# EAGLE design RedpiLite (EAGLE 7.3.0)
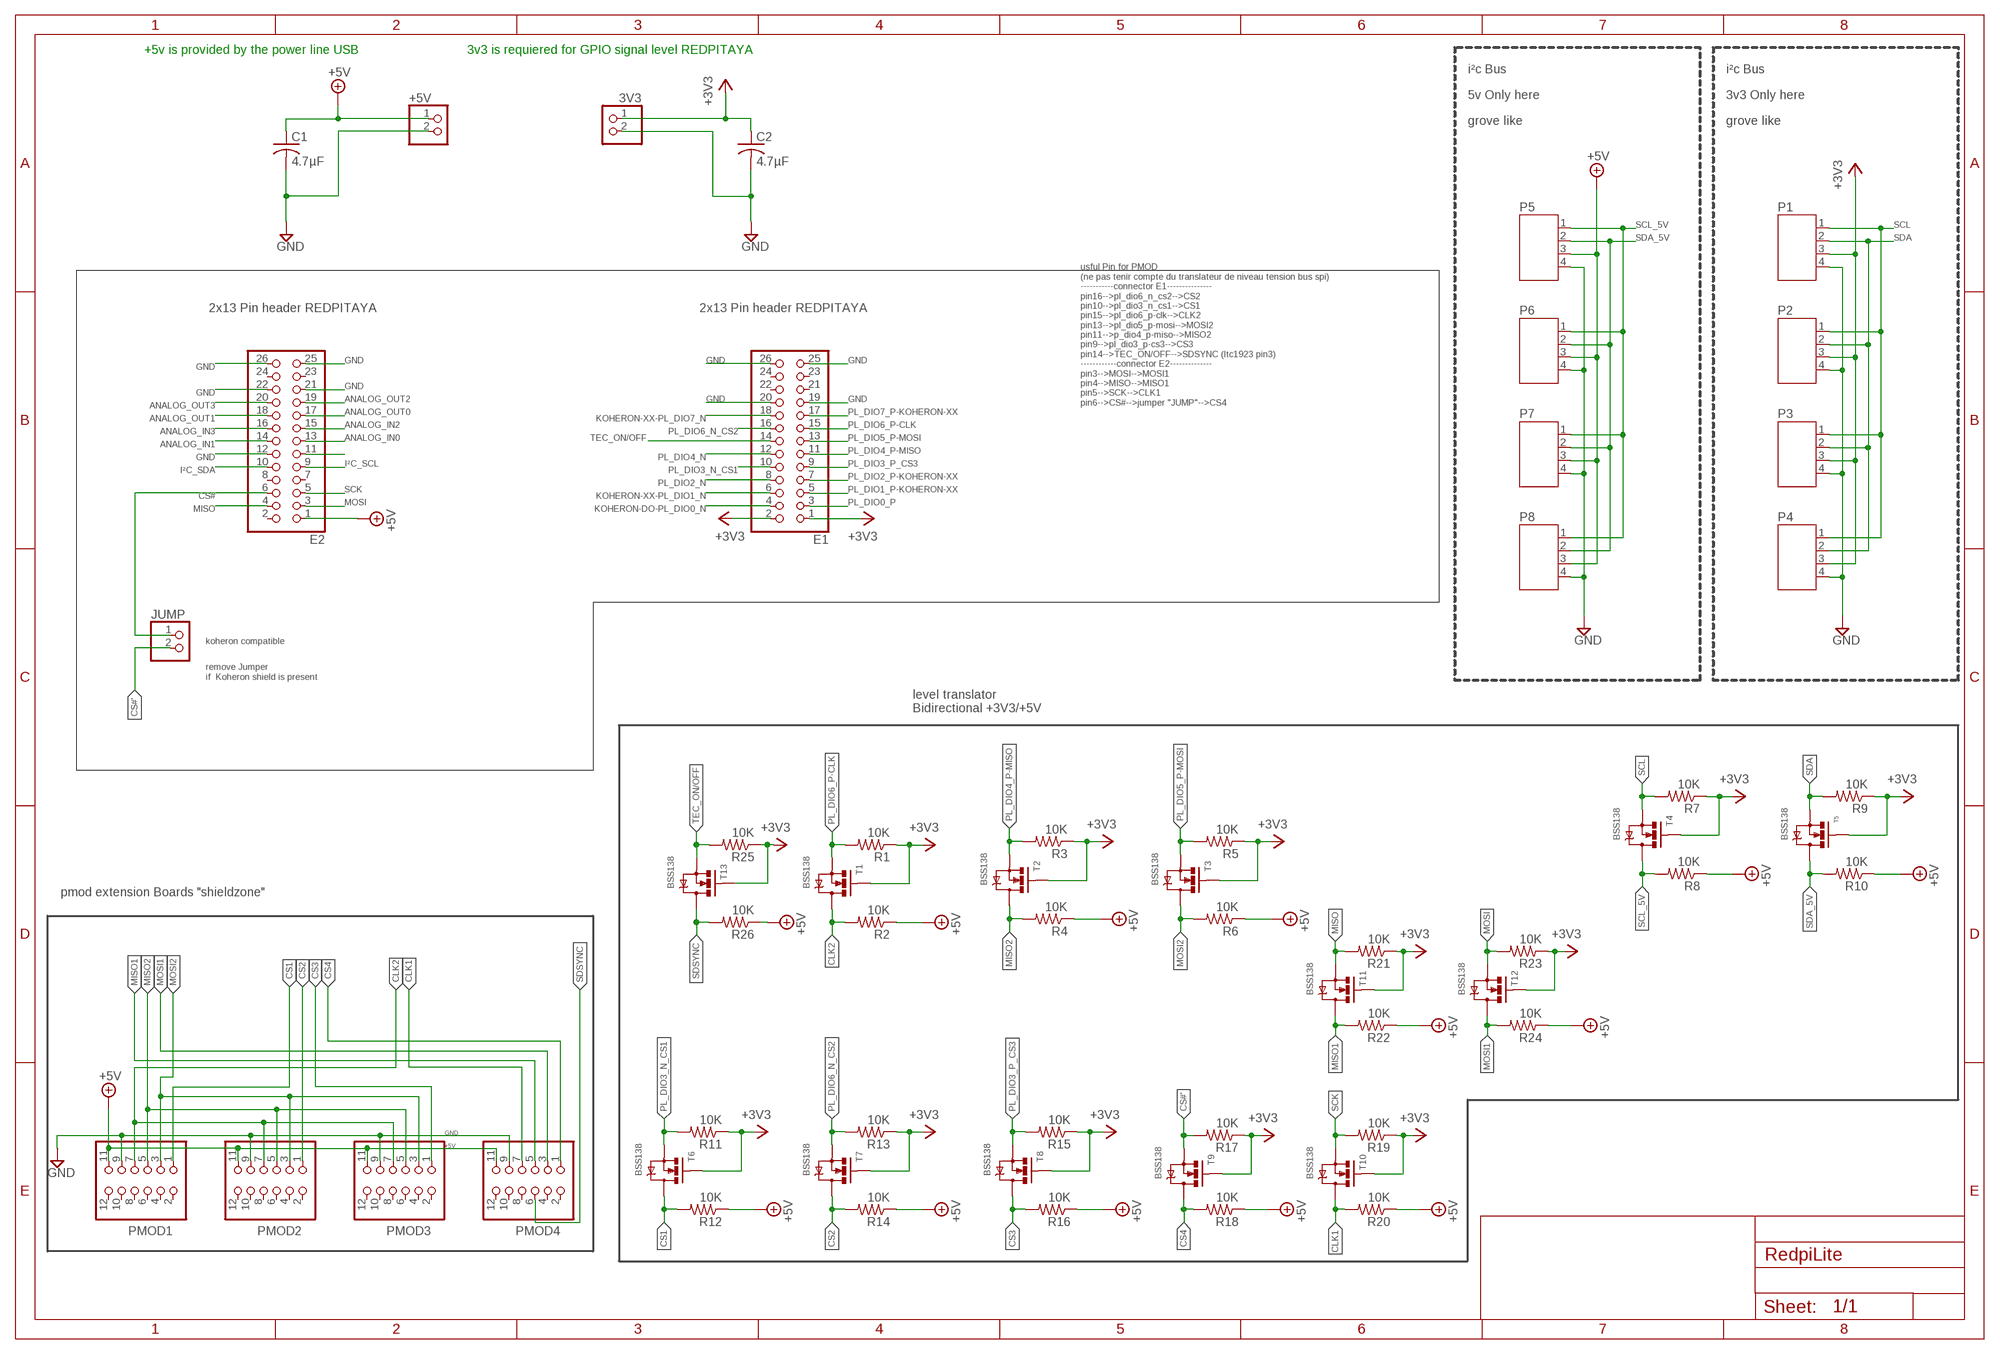
[diagram p0: schematic, sheet 1]

## Parts
3V3  PINHD-1X2  [1X02]
+5V  PINHD-1X2  [1X02]
C1  4.7µF  C-USC1206  [C1206]
C2  4.7µF  C-USC1206  [C1206]
E1  PINHD-2X13  [2X13]
E2  PINHD-2X13  [2X13]
JUMP  PINHD-1X2  [1X02]
P1  JST-PH4GROVE  [JST-PH4]
P2  JST-PH4GROVE  [JST-PH4]
P3  JST-PH4GROVE  [JST-PH4]
P4  JST-PH4GROVE  [JST-PH4]
P5  JST-PH4GROVE  [JST-PH4]
P6  JST-PH4GROVE  [JST-PH4]
P7  JST-PH4GROVE  [JST-PH4]
P8  JST-PH4GROVE  [JST-PH4]
PMOD1  PINHD-2X6/90  [2X06/90]
PMOD2  PINHD-2X6/90  [2X06/90]
PMOD3  PINHD-2X6/90  [2X06/90]
PMOD4  PINHD-2X6/90  [2X06/90]
R1  10K  RESISTOR0603-RES  [0603-RES]
R2  10K  RESISTOR0603-RES  [0603-RES]
R3  10K  RESISTOR0603-RES  [0603-RES]
R4  10K  RESISTOR0603-RES  [0603-RES]
R5  10K  RESISTOR0603-RES  [0603-RES]
R6  10K  RESISTOR0603-RES  [0603-RES]
R7  10K  RESISTOR0603-RES  [0603-RES]
R8  10K  RESISTOR0603-RES  [0603-RES]
R9  10K  RESISTOR0603-RES  [0603-RES]
R10  10K  RESISTOR0603-RES  [0603-RES]
R11  10K  RESISTOR0603-RES  [0603-RES]
R12  10K  RESISTOR0603-RES  [0603-RES]
R13  10K  RESISTOR0603-RES  [0603-RES]
R14  10K  RESISTOR0603-RES  [0603-RES]
R15  10K  RESISTOR0603-RES  [0603-RES]
R16  10K  RESISTOR0603-RES  [0603-RES]
R17  10K  RESISTOR0603-RES  [0603-RES]
R18  10K  RESISTOR0603-RES  [0603-RES]
R19  10K  RESISTOR0603-RES  [0603-RES]
R20  10K  RESISTOR0603-RES  [0603-RES]
R21  10K  RESISTOR0603-RES  [0603-RES]
R22  10K  RESISTOR0603-RES  [0603-RES]
R23  10K  RESISTOR0603-RES  [0603-RES]
R24  10K  RESISTOR0603-RES  [0603-RES]
R25  10K  RESISTOR0603-RES  [0603-RES]
R26  10K  RESISTOR0603-RES  [0603-RES]
T1  BSS138  MOSFET-NCHANNELSMD  [SOT23-3]
T2  BSS138  MOSFET-NCHANNELSMD  [SOT23-3]
T3  BSS138  MOSFET-NCHANNELSMD  [SOT23-3]
T4  BSS138  MOSFET-NCHANNELSMD  [SOT23-3]
T5  BSS138  MOSFET-NCHANNELSMD  [SOT23-3]
T6  BSS138  MOSFET-NCHANNELSMD  [SOT23-3]
T7  BSS138  MOSFET-NCHANNELSMD  [SOT23-3]
T8  BSS138  MOSFET-NCHANNELSMD  [SOT23-3]
T9  BSS138  MOSFET-NCHANNELSMD  [SOT23-3]
T10  BSS138  MOSFET-NCHANNELSMD  [SOT23-3]
T11  BSS138  MOSFET-NCHANNELSMD  [SOT23-3]
T12  BSS138  MOSFET-NCHANNELSMD  [SOT23-3]
T13  BSS138  MOSFET-NCHANNELSMD  [SOT23-3]

## Nets
+3V3: 3V3.1 C2.1 E1.1 E1.2 P1.3 P2.3 P3.3 P4.3 R1.1 R3.1 R5.1 R7.1 R9.1 R11.1 R13.1 R15.1 R17.1 R19.1 R21.1 R23.1 R25.1 T1.1(G) T2.1(G) T3.1(G) T4.1(G) T5.1(G) T6.1(G) T7.1(G) T8.1(G) T9.1(G) T10.1(G) T11.1(G) T12.1(G) T13.1(G)
+5V: +5V.1 C1.1 E2.1 P5.3 P6.3 P7.3 P8.3 PMOD1.11 PMOD2.11 PMOD3.11 PMOD4.11 R2.1 R4.1 R6.1 R8.1 R10.1 R12.1 R14.1 R16.1 R18.1 R20.1 R22.1 R24.1 R26.1
ANALOG_IN0: E2.13
ANALOG_IN1: E2.14
ANALOG_IN2: E2.15
ANALOG_IN3: E2.16
ANALOG_OUT0: E2.17
ANALOG_OUT1: E2.18
ANALOG_OUT2: E2.19
ANALOG_OUT3: E2.20
CLK1: PMOD4.7 R20.2 T10.3(D)
CLK2: PMOD1.7 PMOD2.7 PMOD3.7 R2.2 T1.3(D)
CS1: PMOD1.1 R12.2 T6.3(D)
CS2: PMOD2.1 R14.2 T7.3(D)
CS3: PMOD3.1 R16.2 T8.3(D)
CS4: PMOD4.1 R18.2 T9.3(D)
CS#: E2.6 JUMP.1
CS#': JUMP.2 R17.2 T9.2(S)
GND: 3V3.2 +5V.2 C1.2 C2.2 E1.19 E1.20 E1.25 E1.26 E2.12 E2.21 E2.22 E2.25 E2.26 P1.4 P2.4 P3.4 P4.4 P5.4 P6.4 P7.4 P8.4 PMOD1.9 PMOD2.9 PMOD3.9 PMOD4.9
I²C_SCL: E2.9
I²C_SDA: E2.10
KOHERON-DO-PL_DIO0_N: E1.4
KOHERON-XX-PL_DIO1_N: E1.6
KOHERON-XX-PL_DIO7_N: E1.18
MISO: E2.4 R21.2 T11.2(S)
MISO1: PMOD4.5 R22.2 T11.3(D)
MISO2: PMOD1.5 PMOD2.5 PMOD3.5 R4.2 T2.3(D)
MOSI: E2.3 R23.2 T12.2(S)
MOSI1: PMOD4.3 R24.2 T12.3(D)
MOSI2: PMOD1.3 PMOD2.3 PMOD3.3 R6.2 T3.3(D)
N$15: E2.11
PL_DIO0_P: E1.3
PL_DIO1_P-KOHERON-XX: E1.5
PL_DIO2_N: E1.8
PL_DIO2_P-KOHERON-XX: E1.7
PL_DIO3_N_CS1: E1.10 R11.2 T6.2(S)
PL_DIO3_P_CS3: E1.9 R15.2 T8.2(S)
PL_DIO4_N: E1.12
PL_DIO4_P-MISO: E1.11 R3.2 T2.2(S)
PL_DIO5_P-MOSI: E1.13 R5.2 T3.2(S)
PL_DIO6_N_CS2: E1.16 R13.2 T7.2(S)
PL_DIO6_P-CLK: E1.15 R1.2 T1.2(S)
PL_DIO7_P-KOHERON-XX: E1.17
SCK: E2.5 R19.2 T10.2(S)
SCL: P1.1 P2.1 P3.1 P4.1 R7.2 T4.2(S)
SCL_5V: P5.1 P6.1 P7.1 P8.1 R8.2 T4.3(D)
SDA: P1.2 P2.2 P3.2 P4.2 R9.2 T5.2(S)
SDA_5V: P5.2 P6.2 P7.2 P8.2 R10.2 T5.3(D)
SDSYNC: PMOD4.6 R26.2 T13.3(D)
TEC_ON/OFF: E1.14 R25.2 T13.2(S)
Unconnected: E1.21 E1.22 E1.23 E1.24 E2.2 E2.7 E2.8 E2.23 E2.24 PMOD1.2 PMOD1.4 PMOD1.6 PMOD1.8 PMOD1.10 PMOD1.12 PMOD2.2 PMOD2.4 PMOD2.6 PMOD2.8 PMOD2.10 PMOD2.12 PMOD3.2 PMOD3.4 PMOD3.6 PMOD3.8 PMOD3.10 PMOD3.12 PMOD4.2 PMOD4.4 PMOD4.8 PMOD4.10 PMOD4.12

## Notes on the sheet
- +5v is provided by the power line USB | 3v3 is requiered for GPIO signal level REDPITAYA
- i²c Bus | i²c Bus
- 5v Only here | 3v3 Only here
- grove like | grove like
- 2x13 Pin header REDPITAYA | 2x13 Pin header REDPITAYA
- usful Pin for PMOD 
  (ne pas tenir compte du translateur de niveau tension bus spi)
  -----------connector E1---------------
  pin16-->pl_dio6_n_cs2-->CS2
  pin10-->pl_dio3_n_cs1-->CS1
  pin15-->pl_dio6_p-clk-->CLK2
  pin13-->pl_dio5_p-mosi-->MOSI2
  pin11-->p_dio4_p-miso-->MISO2
  pin9-->pl_dio3_p-cs3-->CS3
  pin14-->TEC_ON/OFF-->SDSYNC (ltc1923 pin3)
  ------------connector E2--------------
  pin3-->MOSI-->MOSI1
  pin4-->MISO-->MISO1
  pin5-->SCK-->CLK1
  pin6-->CS#-->jumper "JUMP"-->CS4
- koheron compatible
- remove Jumper
  if  Koheron shield is present
- level translator
  Bidirectional +3V3/+5V
- pmod extension Boards "shieldzone"

## Library data of the parts
3V3 +5V JUMP = pinhead:PINHD-1X2: PIN HEADER
C1 C2 = rcl:C-US: CAPACITOR, American symbol
E1 E2 = pinhead:PINHD-2X13: PIN HEADER
P1-P8 = grove:JST-PH4
PMOD1-PMOD4 = pinhead:PINHD-2X6: PIN HEADER
R1-R26 = SparkFun:RESISTOR: Resistor Basic schematic elements and footprints for 0603, 1206, and PTH resistors.
T1-T13 = SparkFun:MOSFET-NCHANNEL

## Board
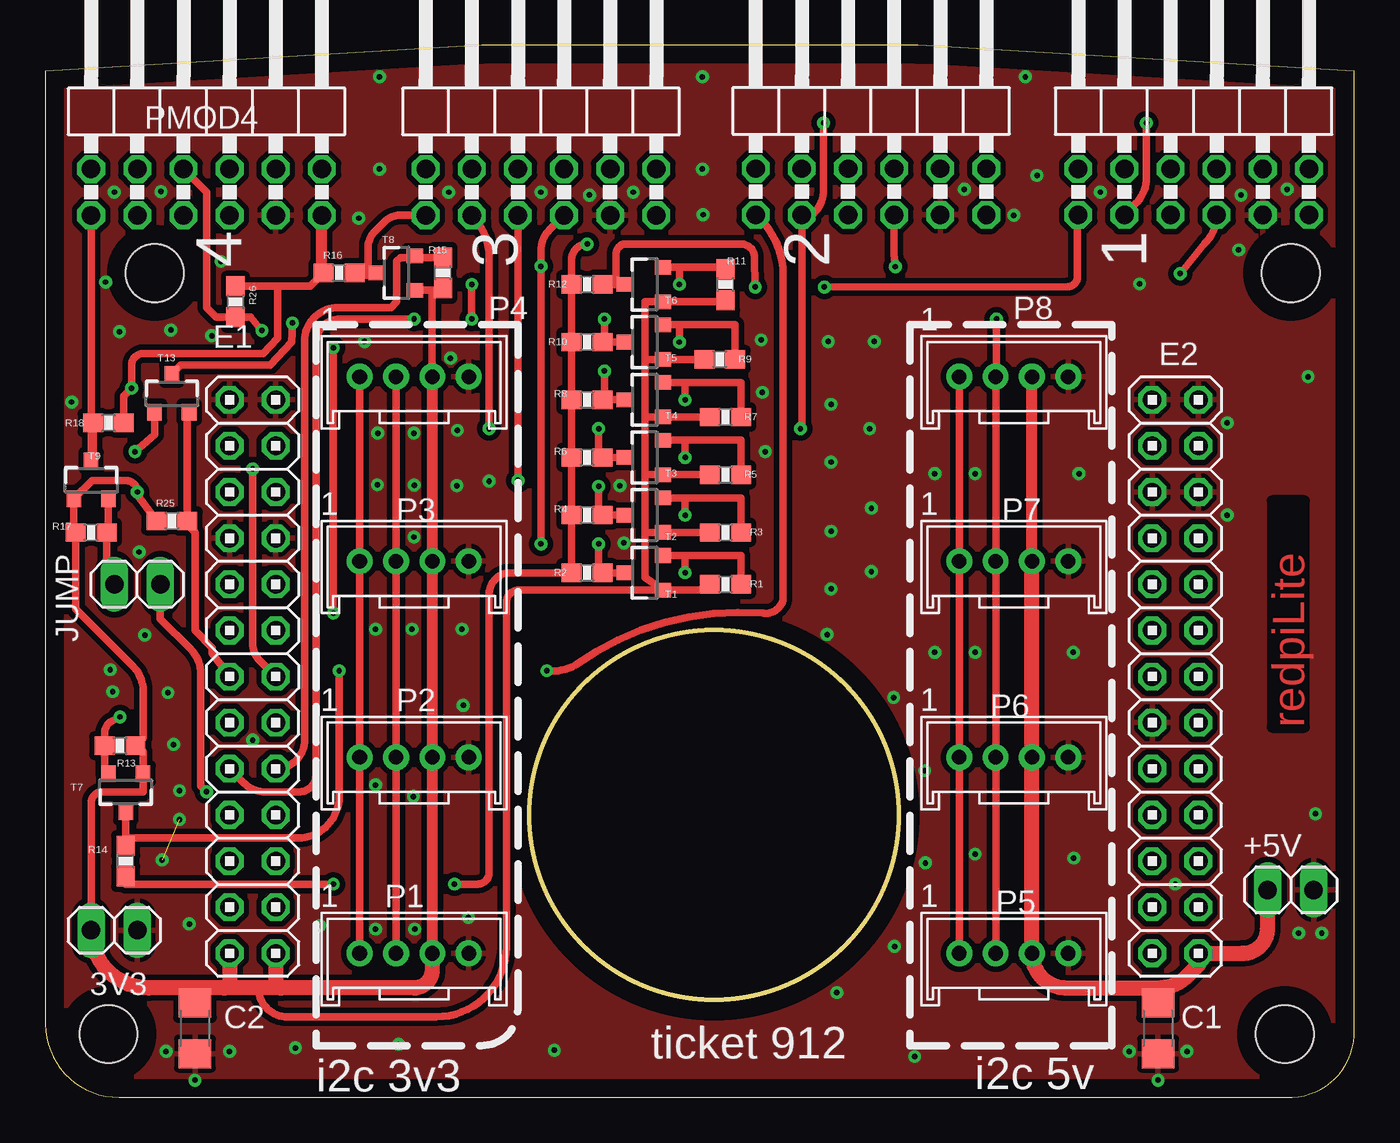
[diagram p1: board, top side]
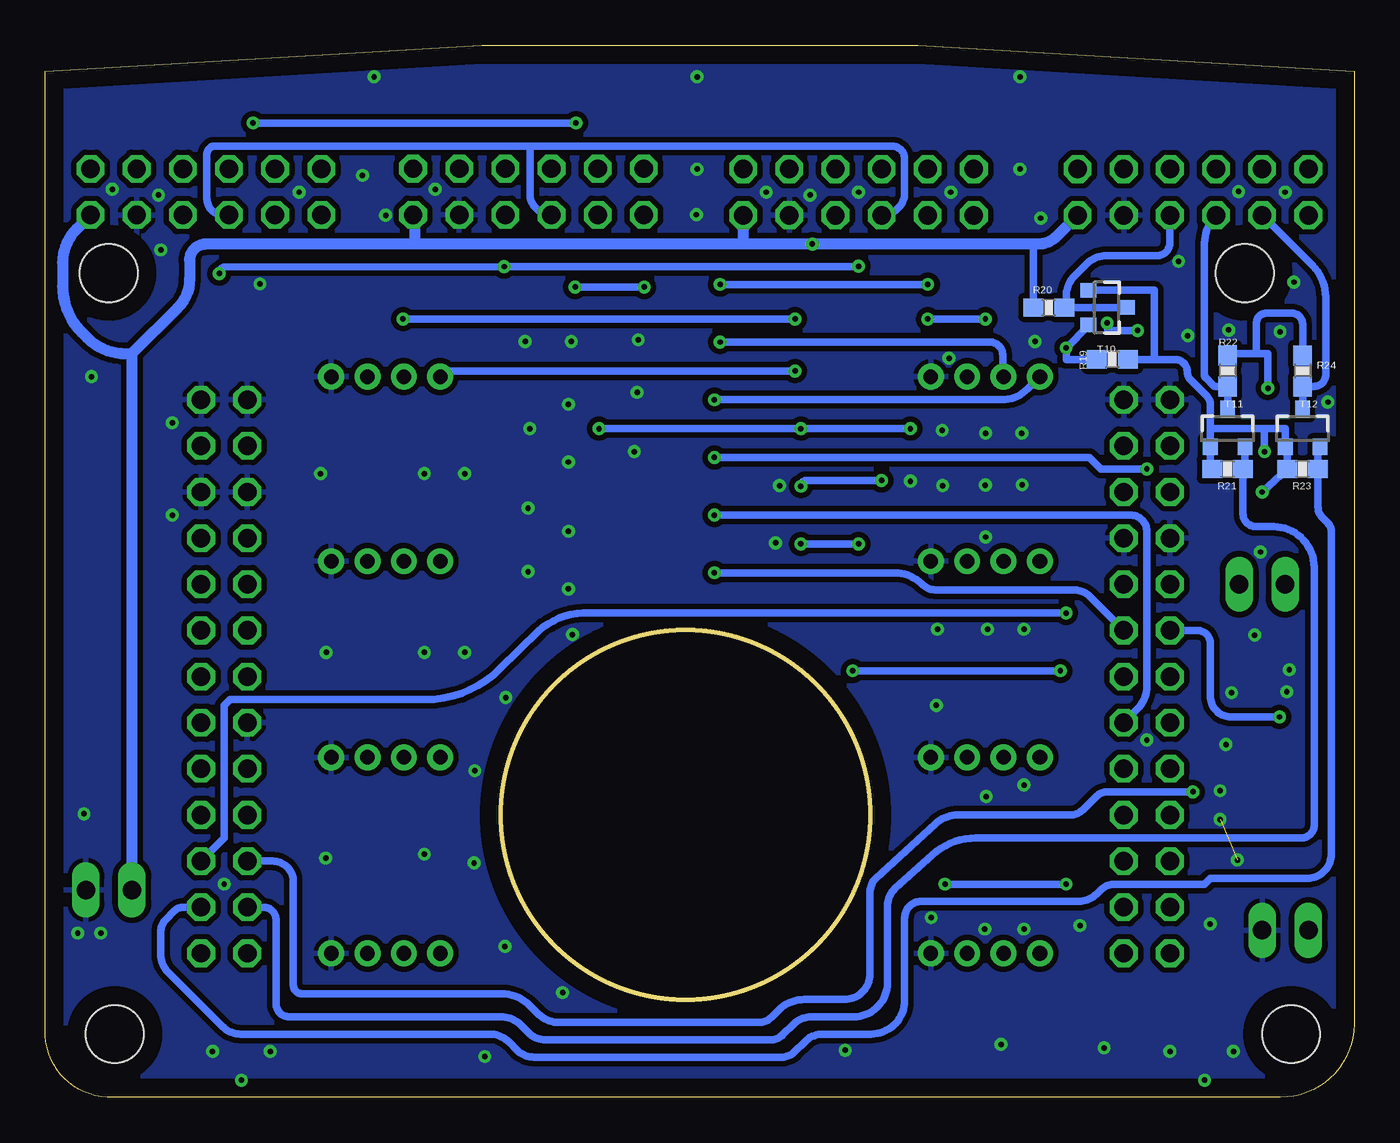
[diagram p2: board, bottom side, seen from below]

Size 72.05 x 57.92 mm. Coordinates in mm from the lower left corner, seen from the top.
Outline: 72.05,56.5 arc10 0,56.5 0,4.01 arc90 4.05,0 68.66,0 arc90 72.05,3.71 72.05,56.5
Outline: circle at 36.81,15.54 radius 10.16
Copper layers (1*16): Top 0.035mm / dielectric 1.5mm / Bottom 0.035mm
Design rules "default": minimum track width 10mil, minimum drill 24mil, track to track 8mil, track to pad 8mil, pad to pad 8mil, via to via 8mil, smd to smd 8mil, copper to edge 40mil, drill to drill 8mil, minimum pad ring 10mil, minimum via ring 8mil, stop-mask expansion 4mil, vias tented up to drill 0mil, thermal gap 10mil
Holes 3.2 mm at 68.24,3.48 6.01,45.39 3.47,3.48 68.56,45.39

### Footprints (pad centres in the part's own frame; a part is rotated, then mirrored left to right if it is on the bottom)
1X02 = drill 1.016 long: 1 -1.27,0; 2 1.27,0
C1206 = smd 1.6 x 1.8: 1 -1.4,0; 2 1.4,0
2X13 = drill 1.016 octagon: 1 -15.24,-1.27; 2 -15.24,1.27; 3 -12.7,-1.27; 4 -12.7,1.27; 5 -10.16,-1.27; 6 -10.16,1.27; 7 -7.62,-1.27; 8 -7.62,1.27; 9 -5.08,-1.27; 10 -5.08,1.27; 11 -2.54,-1.27; 12 -2.54,1.27; 13 0,-1.27; 14 0,1.27; 15 2.54,-1.27; 16 2.54,1.27; 17 5.08,-1.27; 18 5.08,1.27; 19 7.62,-1.27; 20 7.62,1.27; 21 10.16,-1.27; 22 10.16,1.27; 23 12.7,-1.27; 24 12.7,1.27; 25 15.24,-1.27; 26 15.24,1.27
JST-PH4 = drill 0.8 pad 1.422: 1 3,0; 2 1,0; 3 -1,0; 4 -3,0
2X06/90 = drill 1.016 octagon: 1 -6.35,-6.35; 2 -6.35,-3.81; 3 -3.81,-6.35; 4 -3.81,-3.81; 5 -1.27,-6.35; 6 -1.27,-3.81; 7 1.27,-6.35; 8 1.27,-3.81; 9 3.81,-6.35; 10 3.81,-3.81; 11 6.35,-6.35; 12 6.35,-3.81
0603-RES = smd 1.1 x 1: 1 -0.85,0; 2 0.85,0
SOT23-3 = smd 0.8 x 0.9: 1 -0.95,-1; 2 0.95,-1; 3 0,1.1

### Placement (x,y rotation side)
3V3  3.79,9.2 0 top
+5V  68.56,11.42 0 top
C1  61.26,3.8 270 top
C2  8.24,3.8 270 top
E1  11.41,23.16 90 top
E2  62.21,23.16 90 top
JUMP  5.06,28.25 180 top
P1  20.3,7.92 180 top
P2  20.3,18.72 180 top
P3  20.3,29.52 180 top
P4  20.3,39.67 180 top
P5  53.32,7.92 180 top
P6  53.32,18.72 180 top
P7  53.32,29.52 180 top
P8  53.32,39.67 180 top
PMOD1  63.22,54.93 0 top
PMOD2  45.46,54.94 0 top
PMOD3  27.29,54.91 0 top
PMOD4  8.87,54.91 0 top
R1  37.45,28.25 0 top
R2  29.82,28.88 0 top
R3  37.45,31.1 0 top
R4  29.82,32.05 0 top
R5  37.45,34.28 0 top
R6  29.82,35.23 0 top
R7  37.45,37.45 0 top
R8  29.82,38.41 0 top
R9  37.13,40.63 0 top
R10  29.82,41.58 0 top
R11  37.45,44.76 90 top
R12  29.82,44.76 0 top
R13  4.11,19.36 180 top
R14  4.43,13.01 90 top
R15  21.89,45.39 90 top
R16  16.17,45.39 0 top
R17  2.52,31.1 0 top
R18  3.47,37.13 180 top
R19  13.32,40.63 180 bottom
R20  16.81,43.48 0 bottom
R21  6.97,34.59 0 bottom
R22  6.97,39.99 270 bottom
R23  2.84,34.59 0 bottom
R24  2.84,39.99 270 bottom
R25  6.97,31.74 0 top
R26  10.46,43.8 270 top
T1  33,28.88 90 top
T2  33,32.05 90 top
T3  33,35.23 90 top
T4  33,38.41 90 top
T5  33,41.58 90 top
T6  33,44.76 90 top
T7  4.43,16.81 180 top
T8  19.35,45.39 90 top
T9  2.52,33.96 0 top
T10  13.63,43.48 270 bottom
T11  6.97,36.82 0 bottom
T12  2.84,36.82 0 bottom
T13  6.97,38.72 0 top

### Tracks (layer width: path | path; a pad name or v marks a point on that pad's centre or on a via)
+3V3  (via drill 0.3)
  Top 0.406: 21.25,39.67 P4.3 21.3,44.44 T8.1 21.89,44.44 R15.1 | 21.3,37.45 21.3,35.49 | T1.1 33,28.61 33,31.11 | 33,31.11 33,34.28 | 33,34.28 33,37.45 | 33,37.45 33,40.63 | 33,40.63 33,43.8 T6.1 37.66,43.8 arc90 R11.1 | 33,40.63 T5.1 35.96,40.63 R9.1 | 33,37.45 T4.1 35.96,37.45 R7.1 | 33,34.28 T3.1 35.96,34.28 R5.1 | 33,31.11 T2.1 35.96,31.11 R3.1 | T1.1 35.96,27.93 R1.1 | T1.1 33.95,27.93 26.06,27.93 arc90 25.38,27.25 25.38,8.29 arc-90 21.52,4.43 13.32,4.43 arc-90 11.73,6.02 | 3V3.1 2.52,16.2 arc-90 3.14,16.81 5.38,16.81 T7.1 5.38,19.04 R13.1 5.38,19.77 5.38,22.39 arc45 4.83,23.71 1.67,26.87 R17.1 1.57,31.2 T9.1 2.57,33.96 4.43,33.96 arc-90 v5.06,33.33 4.96,33.33 R25.1 | T13.1 6.02,36.5 v4.93,35.55
  Top 0.61: P4.3 21.3,37.45 P3.3 P2.3 P1.3
  Top 0.813: P1.3 21.3,7.02 arc-90 20.3,6.02 13,6.02 | 13,6.02 11.73,6.02 9.82,6.02 | 9.82,6.02 8.55,6.02 | 8.55,6.02 5.7,6.02 arc-90 3V3.1 | C2.1 8.24,5.7 arc-90 8.55,6.02 | E1.2 10.14,6.34 arc-90 9.82,6.02 | E1.1 12.68,6.34 arc90 13,6.02
  Bottom 0.406: R21.1 7.92,35.01 T11.1 | 4.93,36.82 3.79,36.82 3.79,36.81 T12.1 3.69,35.72 R23.1 arc90 4.01,34.28 v5.06,33.33 | 4.93,36.82 7.92,36.82 | 7.92,36.82 T11.1 | T11.1 7.92,36.81 7.92,36.82 | 7.92,36.82 7.92,38.17 arc-45 8.09,38.57 8.99,39.48 arc45 9.19,39.96 9.19,39.96 arc-90 9.86,40.63 11,40.63 | v4.93,35.55 4.93,36.82 | 11,40.63 R19.1 12.46,40.95 | T10.1 11.72,44.44 11,44.44 11,40.63
+5V  (via drill 0.3)
  Top 0.406: R4.1 R2.1 25.61,28.88 arc90 24.43,27.7 24.43,12.37 arc-90 23.79,11.73 v22.52,11.73 | R4.1 R6.1 R8.1 R10.1 R12.1 28.98,46.13 arc-90 v29.82,46.98 | R4.1 28.98,33.01 | v15.86,11.73 4.43,11.73 R14.1 | R18.1 4.32,38.62 v4.74,39.04 4.74,40.31 arc-90 5.38,40.95 11.98,40.95 12.78,41.8 12.78,44.65 | R26.1 12.78,44.65 | 12.78,44.65 14.59,44.65 R16.1
  Top 0.61: P7.3 P8.3 | R16.1 15.22,45.49 PMOD4.11
  Top 0.813: P7.3 P6.3 P5.3 arc90 56.22,6.02 61.26,6.02 | 61.26,6.02 arc45 62.88,6.69 63.48,7.29 E2.1 65.92,7.92 arc90 67.29,9.29 +5V.1 | C1.1 61.26,6.02
  Bottom 0.406: v22.52,11.73 v15.86,11.73 | PMOD4.11 15.86,47.93 | R20.1 17.66,46.88 17.76,46.98 | v4.74,39.04 4.74,40.95 5.38,40.95 | R24.1 2.84,42.59 arc-90 3.41,43.17 4.85,43.17 arc-90 5.38,42.64 5.38,40.95 | 5.38,40.95 6.97,40.95 R22.1
  Bottom 0.61: 15.86,47.93 16.39,47.39 arc45 17.4,46.98 17.76,46.98 v29.82,46.98 33.63,46.98 | 33.63,46.98 51.73,46.98 | 51.73,46.98 63.22,46.98 arc-90 64.12,46.08 64.12,45.05 arc45 64.77,43.46 67.29,40.95 | 67.29,40.95 +5V.1 | PMOD1.11 70.34,47.8 arc-45 71.1,45.97 71.1,44.64 arc-45 70.06,42.13 69.76,41.82 arc-45 67.64,40.95 67.29,40.95 | PMOD2.11 51.73,48.52 51.73,46.98 | PMOD3.11 33.63,46.98
CLK1
  Bottom 0.406: PMOD4.7 10.14,47.05 arc90 10.85,46.34 13.61,46.34 arc-45 14.73,45.88 15.38,45.23 arc-45 15.86,44.08 15.86,43.59 R20.2 T10.3
CLK2  (via drill 0.3)
  Top 0.406: T1.3 R2.2 30.46,28.88 v30.46,30.47 | v62.48,45.36 63.84,47.02 arc45 PMOD1.7 | PMOD3.7 27.76,47.77 arc45 27.29,46.62 v27.29,45.76 v27.29,30.47 | PMOD2.7 46.73,46.42 v46.79,45.74
  Bottom 0.406: v62.48,45.36 arc90 62.18,45.71 v46.79,45.74 27.26,45.74 v27.29,45.76 | v27.29,30.47 v30.46,30.47
CS1  (via drill 0.3)
  Top 0.406: R12.2 31.41,44.76 | 31.41,44.76 T6.3 | PMOD1.1 56.81,48.58 56.81,45.16 arc-90 56.29,44.64 v42.89,44.62 | v39.08,44.62 39.03,46.27 arc90 38.32,46.98 31.92,46.98 arc45 31.6,46.85 arc45 31.41,46.4 31.41,44.76
  Bottom 0.406: v42.89,44.62 v39.08,44.62
CS2  (via drill 0.3)
  Top 0.406: PMOD2.1 39.36,48.34 arc-45 40.62,45.3 40.62,27.46 arc-90 39.5,26.66 arc40 29.19,23.8 arc-36 v27.6,23.48 | v16.17,23.48 16.17,16.56 arc-90 13.88,14.28 4.43,14.28 R14.2 T7.3
  Bottom 0.406: v27.6,23.48 v16.17,23.48
CS3
  Top 0.406: T8.3 17.76,45.39 17.76,46.75 arc-45 18.14,47.68 18.7,48.23 arc-45 19.5,48.56 PMOD3.1
  Top 0.61: R16.2 T8.3
CS4
  Top 0.406: PMOD4.1 T9.3 2.62,35.16 R18.2
CS#  (via drill 0.3)
  Top 0.406: JUMP.1 6.33,26.34 7.99,24.68 arc-45 8.55,23.32 8.55,17.13 v8.87,16.81
  Bottom 0.406: v8.87,16.81 13.58,16.81 arc-45 14.21,16.55 14.94,15.82 arc45 15.62,15.54 21.8,15.54 arc-43 23.05,15.06 26.33,12.05 arc-45 26.65,11.29 26.65,6.8 arc90 28.07,5.38 30.26,5.38 arc-45 31.68,4.8 32.09,4.39 arc45 32.76,4.12 43.77,4.12 arc45 44.89,4.58 45.36,5.04 arc-45 46.95,5.7 57.95,5.7 arc90 58.4,6.15 58.4,11.86 arc-90 59.54,13.01 E2.6
CS#'
  Top 0.406: T9.2 3.47,31.2 R17.2 3.37,28.35 JUMP.2
GND  (via drill 0.3)  (1 unrouted)
  other vias: 22.65,33.67 23.28,9.89 17.57,41.61 24.43,33.93 5.16,30.02 22.68,36.72 18.39,51.1 36.17,51.1 54.59,50.76 39.64,35.55 23,21.58 69.93,15.61 53.32,48.56 65.07,37.13 65.07,32.05 59.67,2.53 62.84,2.53 10.14,2.53 6.65,2.53 31.63,33.67 31.85,30.53 45.38,36.82 39.48,38.82 46.71,22.01 39.41,41.71 60.24,44.79 36.21,48.6 7.92,9.54 11.41,19.67 62.21,11.73 56.62,13.16 61.26,0.94 8.24,0.94 13.76,2.72 15.09,9.45 6.74,22.28 3.57,23.55 28.02,2.59 7.06,19.42 7.38,16.88 7.38,15.29 6.43,13.07 45.48,32.44 46.75,8.31 19.44,2.91 20.26,16.56 18.17,17.2 18.17,9.26 20.33,9.26 48.41,17.98 43.03,25.48 22.94,25.77 20.18,25.77 18.17,25.77 18.27,33.72 20.3,33.71 20.29,30.85 20.28,36.56 18.3,36.57 22.3,40.69 43.26,34.98 43.26,38.15 43.26,31.17 43.26,27.99 45.48,28.94 56.91,34.34 48.97,34.34 48.97,24.5 56.59,24.5 51.19,34.34 51.19,24.5 48.45,12.9 51.19,13.39 43.57,5.77 5.47,25.45 69,9.04 70.27,9.04 17.25,48.41 29.95,49.68 65.83,49.68 68.37,49.99 50.59,49.99 22.21,49.84 27.29,49.84 32.36,49.84 4.08,42.15 58.08,49.84 65.7,46.66 69.51,39.67 43.1,41.61 45.64,41.61 6.9,42.25 47.86,2.24 3.71,22.33 18.39,56.19 36.17,56.19 53.95,56.19 9.16,41.93 6.36,49.87 3.79,49.84 3.31,44.88 9.66,46.02 1.44,38.28
  pour Top (isolate 0.305): 3.79,-0.33 72.37,-0.33 72.37,58.09 -0.02,58.09 -0.02,-0.33
  pour Bottom (isolate 0.305): -0.02,56.82 -0.02,-0.33 72.37,-0.33 72.37,58.09 -0.02,58.09
MISO
  Bottom 0.406: T11.2 6.02,35.01 R21.2 6.12,32.12 arc-90 5.41,31.42 4.43,31.42 arc90 2.2,29.19 2.2,14.98 arc90 2.91,14.28 20.83,14.28 arc-42 23.22,13.35 25.27,11.49 arc-48 25.7,10.52 25.7,6.28 arc90 27.55,4.43 29.87,4.43 arc-45 30.88,4.02 31.44,3.46 arc45 32.15,3.16 44.52,3.16 arc45 45.45,3.55 45.87,3.97 arc-45 46.99,4.43 58.64,4.43 arc90 59.35,5.14 59.35,9.75 arc-90 60.06,10.46 E2.4
MISO1
  Bottom 0.406: T11.3 R22.2 7.63,39.14 arc45 7.75,39.19 8.18,39.62 arc45 8.24,39.76 8.24,47.03 arc45 PMOD4.5
MISO2  (via drill 0.3)
  Top 0.406: T2.3 R4.2 arc-90 30.46,32.27 v30.46,33.64 | v26.02,33.96 PMOD3.5
  Bottom 0.406: PMOD1.5 62.27,48.58 arc90 63.16,49.47 63.16,51.93 arc90 62.71,52.38 45.38,52.38 | 45.38,52.38 25.46,52.38 arc90 24.75,51.66 24.75,49.84 arc90 PMOD3.5 | v30.46,33.64 arc90 30.14,33.96 v26.02,33.96 | PMOD2.5 arc90 45.38,49.78 45.38,52.38
MOSI
  Bottom 0.406: T12.2 1.99,35.72 R23.2 1.99,32.51 arc-45 1.74,31.91 1.45,31.62 arc45 1.25,31.14 1.25,13.4 arc90 2.6,12.05 7.92,12.05 8.24,11.73 13.16,11.73 arc-45 13.97,11.4 14.17,11.2 arc45 15.17,10.78 23.85,10.78 arc-90 24.75,9.88 24.75,5.33 arc90 26.6,3.48 29.24,3.48 arc-45 30.24,3.06 30.8,2.5 arc45 31.51,2.21 45.16,2.21 arc45 46.08,2.59 46.5,3.01 arc-45 47.63,3.48 61.3,3.48 arc45 62.31,3.9 65.29,6.87 arc45 65.7,7.88 65.7,9.1 arc45 65.41,9.81 64.96,10.26 arc45 64.46,10.46 E2.3
MOSI1
  Bottom 0.406: T12.3 R24.2 2.19,39.14 arc-90 1.57,39.76 1.57,44.07 arc-45 2.28,45.78 PMOD4.3
MOSI2  (via drill 0.3)
  Top 0.406: T3.3 R6.2 arc-90 30.46,35.45 v30.46,36.82 | v24.43,36.82 24.43,46.27 arc45 PMOD3.3 | v60.62,53.65 60.62,50.64 arc-45 60.02,49.19 PMOD1.3 | v42.84,53.65 42.84,49.97 arc-45 42.3,48.66 42.23,48.59 PMOD2.3 41.65,36.89 v41.57,36.82
  Bottom 0.406: v24.43,36.82 v30.46,36.82 v41.57,36.82 | v42.84,53.65 v60.62,53.65
PL_DIO3_N_CS1  (via drill 0.3)
  Top 0.406: R11.2 37.66,45.7 T6.2 34.9,45.7 34.9,45.71 v34.9,44.76 | E1.10 10.91,17.32 arc45 12.12,16.81 13.95,16.81 arc90 14.9,17.77 14.9,41.55 arc-90 16.21,42.85 v20.3,42.85 | v23.48,44.76 v23.48,42.85
  Bottom 0.406: v34.9,44.76 v23.48,44.76 | v20.3,42.85 v23.48,42.85
PL_DIO3_P_CS3
  Top 0.406: T8.2 20.35,46.24 R15.2 19.56,46.24 19.35,46.02 19.35,43.8 19.03,43.48 16.13,43.48 arc90 14.27,41.62 14.27,19.67 arc-90 E1.9
PL_DIO4_P-MISO  (via drill 0.3)
  Top 0.406: 35.22,33 38.29,33 R3.2 | T2.2 35.22,33 | 35.22,33 v35.22,32.05
  Bottom 0.406: v35.22,32.05 12.31,32.05 arc90 11.41,31.16 11.41,22.64 arc45 11.94,21.37 E1.11
PL_DIO5_P-MOSI  (via drill 0.3)
  Top 0.406: R5.2 38.29,36.18 T3.2 35.22,36.18 v35.22,35.23 | v11.41,34.59 11.41,24.98 arc45 11.79,24.05 E1.13
  Bottom 0.406: v35.22,35.23 14.59,35.23 13.95,34.59 v11.41,34.59
PL_DIO6_N_CS2  (via drill 0.3)
  Top 0.406: T7.2 3.26,17.81 R13.2 3.26,20.06 arc-64 3.68,20.73 v4.11,20.94
  Bottom 0.406: E1.16 8.63,25.7 arc90 7.92,25 7.92,22.09 arc-90 6.77,20.94 v4.11,20.94
PL_DIO6_P-CLK  (via drill 0.3)
  Top 0.406: 35.22,29.83 38.29,29.83 R1.2 | T1.2 35.22,29.83 | 35.22,29.83 v35.22,28.88
  Bottom 0.406: v35.22,28.88 25.28,28.88 arc45 23.83,28.28 arc-45 22.98,27.93 15.38,27.93 arc45 14.57,27.59 E1.15
SCK  (via drill 0.3)
  Top 0.406: v15.86,41.26 v15.86,26.66
  Bottom 0.406: E2.5 62.21,14.28 62.21,21.58 61.89,21.89 51.15,21.89 arc-45 47.01,23.61 44.9,25.67 arc45 42.12,26.66 v15.86,26.66 | R19.2 15.86,40.63 v15.86,41.26 14.63,42.48 T10.2
SCL  (via drill 0.3)
  Top 0.406: P4.1 P3.1 P2.1 P1.1 | T4.2 35.22,39.35 | 35.22,39.35 38.29,39.35 R7.2 | v35.22,38.41 35.22,39.35
  Bottom 0.406: P4.1 17.98,38.99 arc45 19.4,38.41 v35.22,38.41
SCL_5V  (via drill 0.3)
  Top 0.406: P5.1 P6.1 P7.1 P8.1 | R8.2 T4.3 30.78,38.41 v30.78,39.99
  Bottom 0.406: v30.78,39.99 50.32,39.99 P8.1
SDA  (via drill 0.3)
  Top 0.406: P1.2 P2.2 P3.2 P4.2 | R9.2 37.98,42.53 T5.2 34.9,42.53 v34.9,41.58
  Bottom 0.406: v34.9,41.58 20.05,41.58 arc90 19.35,40.88 19.35,39.72 P4.2
SDA_5V  (via drill 0.3)
  Top 0.406: P5.2 P6.2 P7.2 P8.2 | P8.2 52.32,38.41 | R10.2 T5.3 30.78,41.58 v30.78,42.85 | v52.37,42.85 52.37,39.72 P8.2
  Bottom 0.406: v30.78,42.85 v52.37,42.85
SDSYNC  (via drill 0.3)
  Top 0.406: T13.3 7.45,40.31 12.36,40.31 13.57,41.58 v13.6,42.63 | PMOD4.6 8.87,49.84 8.87,43.48 9.4,42.95 R26.2 11.31,42.95 v11.92,42.22
  Bottom 0.406: v11.92,42.22 13.57,42.22 v13.6,42.63
TEC_ON/OFF
  Top 0.406: E1.14 9.19,24.43 9.19,24.75 8.24,25.7 8.24,31.1 7.82,31.52 R25.2 7.82,37.62 T13.2

### Text on the board
Top: redpiLite
tNames: 4 | 3 | 2 | 1 | ticket 912 | i2c 5v | i2c 3v3
Measures: FAN